# Altium schematic sheet MCU-IO.SchDoc: =ProjectTitle
size 297 x 209 mm; Address1: Address1; Address2: Address2; Address3: Address3; Address4: Address4; SheetNumber: 3; SheetTotal: 16; Scale: 1:1; DocumentType: Схема электрическая принципиальная
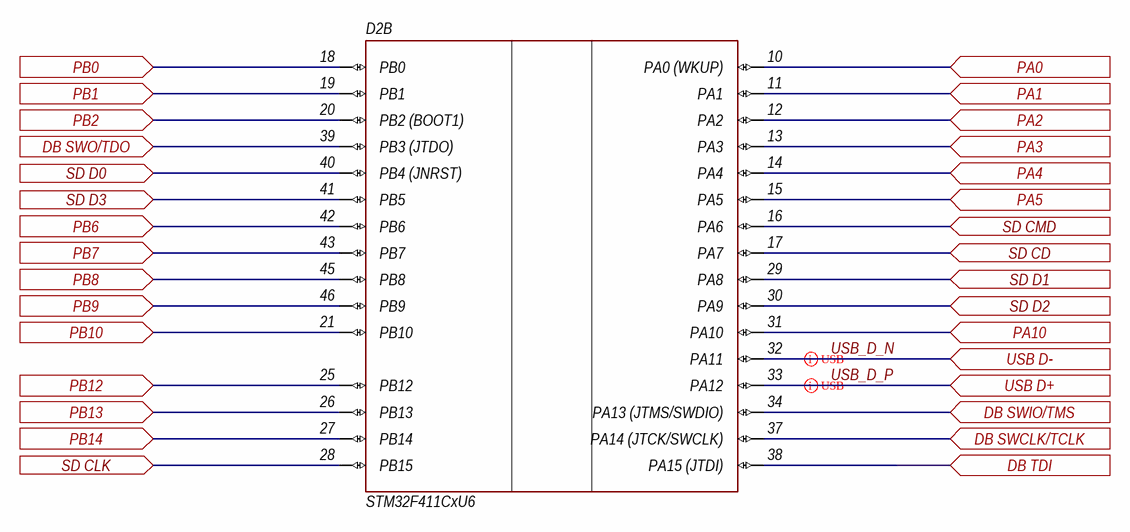
[diagram p0: MCU-IO.SchDoc]

## Parts
D2  STM32F411CxU6  [48-UFQFPN]  (part B of 2)

## Ports
DB SWCLK/TCLK (in), DB SWIO/TMS (in), DB SWO/TDO (in), DB TDI (in), PA0 (in), PA1 (in), PA2 (in), PA3 (in), PA4 (in), PA5 (in), PA10 (in), PB0 (in), PB1 (in), PB2 (in), PB6 (in), PB7 (in), PB8 (in), PB9 (in), PB10 (in), PB12 (in), PB13 (in), PB14 (in), SD CD (in), SD CLK (in), SD CMD (in), SD D0 (in), SD D1 (in), SD D2 (in), SD D3 (in), USB D+ (in), USB D- (in)

## Nets
DB SWCLK/TCLK: D2.37(PA14_(JTCK/SWCLK)) ; port DB SWCLK/TCLK
DB SWIO/TMS: D2.34(PA13_(JTMS/SWDIO)) ; port DB SWIO/TMS
DB SWO/TDO: D2.39(PB3_(JTDO)) ; port DB SWO/TDO
DB TDI: D2.38(PA15_(JTDI)) ; port DB TDI
PA0: D2.10(PA0_(WKUP)) ; port PA0
PA1: D2.11(PA1) ; port PA1
PA2: D2.12(PA2) ; port PA2
PA3: D2.13(PA3) ; port PA3
PA4: D2.14(PA4) ; port PA4
PA5: D2.15(PA5) ; port PA5
PA10: D2.31(PA10) ; port PA10
PB0: D2.18(PB0) ; port PB0
PB1: D2.19(PB1) ; port PB1
PB2: D2.20(PB2_(BOOT1)) ; port PB2
PB6: D2.42(PB6) ; port PB6
PB7: D2.43(PB7) ; port PB7
PB8: D2.45(PB8) ; port PB8
PB9: D2.46(PB9) ; port PB9
PB10: D2.21(PB10) ; port PB10
PB12: D2.25(PB12) ; port PB12
PB13: D2.26(PB13) ; port PB13
PB14: D2.27(PB14) ; port PB14
SD CD: D2.17(PA7) ; port SD CD
SD CLK: D2.28(PB15) ; port SD CLK
SD CMD: D2.16(PA6) ; port SD CMD
SD D0: D2.40(PB4_(JNRST)) ; port SD D0
SD D1: D2.29(PA8) ; port SD D1
SD D2: D2.30(PA9) ; port SD D2
SD D3: D2.41(PB5) ; port SD D3
USB_D_N: D2.32(PA11) ; port USB D-
USB_D_P: D2.33(PA12) ; port USB D+

## Layout directives
differential pair; differential pair class D90; rule Matched Net Lengths [Tolerance = 0.5mm]: USB_D_N, USB_D_P

## Notes on the sheet
- Изм.
- Лист
- № докум.
- Подп.
- Дата
- Копировал
- Формат А4

## Library data of the parts
D2 = STM32F411CxU6: STM32, Cortex-M4; Manufacturer: ST Microelectronics; Model: STM32F411CxU6; ComponentKind: STM32, 2.0-3.6V, 48-UFQFPN; HelpURL: https://datasheet.lcsc.com/lcsc/2107091825_STMicroelectronics-STM32F411VCT6_C1339312.pdf